# EasyEDA Pro project StageAudioPlayer.eprj

# Schematic Schematic1
Board Name: Board1; Create Date: 2025-11-23; Page Name: P1; Project Name: StageAudioPlayer; Schematic Name: Schematic1; Update Date: 2025-11-23; Company: EasyEDA.com; Page Size: A4; Version: V1.0
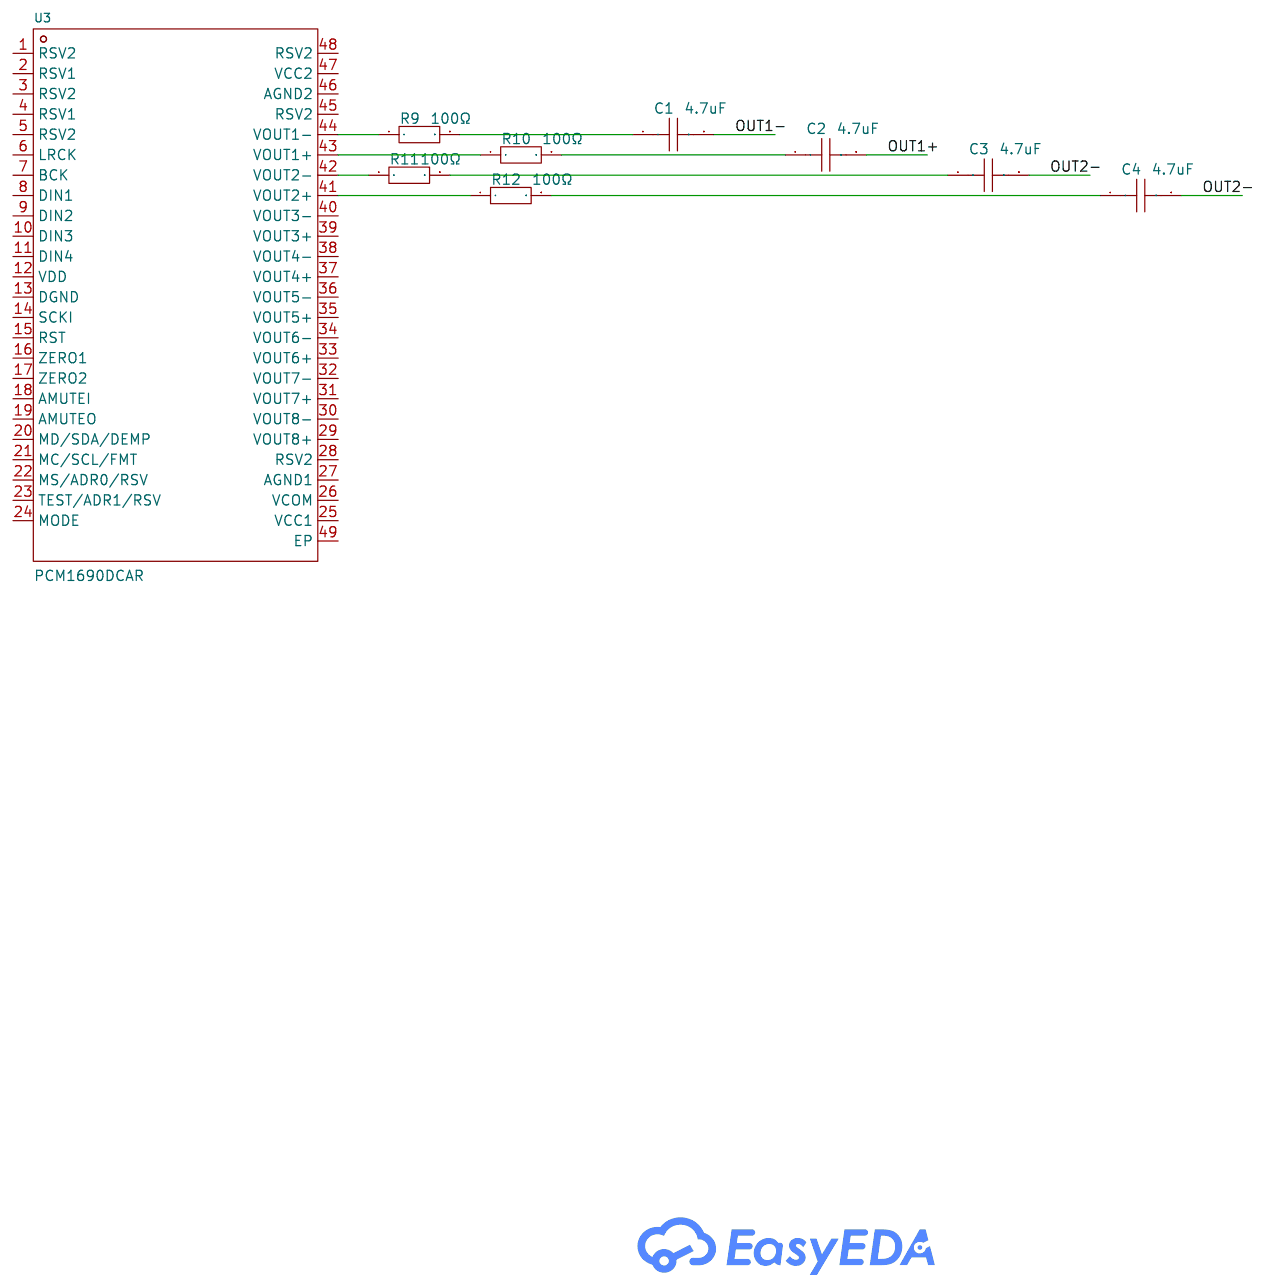
[diagram p0: schematic sheet]

## Parts
C1  4.7uF  [CAP-TH_L28.5-W15.5-P26.0-D0.8]
C2  4.7uF  [CAP-TH_L28.5-W15.5-P26.0-D0.8]
C3  4.7uF  [CAP-TH_L28.5-W15.5-P26.0-D0.8]
C4  4.7uF  [CAP-TH_L28.5-W15.5-P26.0-D0.8]
R9  100Ω  [R0603]
R10  100Ω  [R0603]
R11  100Ω  [R0603]
R12  100Ω  [R0603]
U3  PCM1690DCAR  [HTSSOP-48_L12.5-W6.1-P0.50-LS8.1-BL-EP-1]

## Library data of the parts
C1-C4 = KP475J2J2603: LCSC Part Name: 4.7uF ±5% 630V; Supplier Part: C3019080; Manufacturer: KYET(科雅); Supplier Footprint: 插件,P=26mm; JLCPCB Part Class: Extended Part; Datasheet: https://item.szlcsc.com/datasheet/KP475J2J2603/3534045.html; Supplier: LCSC; Tolerance: ±5%; Voltage Rating: 630V; Operating Temperature: -40℃~+100℃
R9-R12 = 0603WAF1000T5E: LCSC Part Name: 100Ω ±1% 100mW 厚膜电阻; Supplier Part: C22775; Manufacturer: UNI-ROYAL(厚声); Supplier Footprint: 0603; JLCPCB Part Class: Basic Part; Datasheet: https://atta.szlcsc.com/upload/public/pdf/source/20200306/C422600_1E6D84923E4A46A82E41ADD87F860B5C.pdf; Supplier: LCSC; Type: Thick Film Resistors; Tolerance: ±1%; Temperature Coefficient: ±200ppm/℃; Operating Temperature Range: -55℃~+155℃
U3 = PCM1690DCAR: Supplier Part: C181276; Manufacturer: TI(德州仪器); Supplier Footprint: HTSSOP-48-EP-6.1mm; JLCPCB Part Class: Extended Part; Datasheet: https://www.ti.com/cn/lit/gpn/pcm1690; Supplier: LCSC; Resolution(Bits): 24; Number of Channels: 8; Interface: I2C; Voltage - Supply: 4.5V~5.5V; Operating Temperature: -40℃~+85℃; Sampling Rate: 192kHz

## Nets
OUT1+: C2.2
OUT1-: C1.2
OUT2-: C3.2 C4.2
Net-(C1-1): C1.1 R9.2
Net-(C2-1): C2.1 R10.2
Net-(C3-1): C3.1 R11.2
Net-(C4-1): C4.1 R12.2
Net-(R9-1): R9.1 U3.44(VOUT1-)
Net-(R10-1): R10.1 U3.43(VOUT1+)
Net-(R11-1): R11.1 U3.42(VOUT2-)
Net-(R12-1): R12.1 U3.41(VOUT2+)

Not connected (* = marked no-connect by the designer): U3 1(RSV2) 2(RSV1) 3(RSV2) 4(RSV1) 5(RSV2) 6(LRCK) 7(BCK) 8(DIN1) 9(DIN2) 10(DIN3) 11(DIN4) 12(VDD) 13(DGND) 14(SCKI) 15(RST) 16(ZERO1) 17(ZERO2) 18(AMUTEI) 19(AMUTEO) 20(MD/SDA/DEMP) 21(MC/SCL/FMT) 22(MS/ADR0/RSV) 23(TEST/ADR1/RSV) 24(MODE) 25(VCC1) 26(VCOM) 27(AGND1) 28(RSV2) 29(VOUT8+) 30(VOUT8-) 31(VOUT7+) 32(VOUT7-) 33(VOUT6+) 34(VOUT6-) 35(VOUT5+) 36(VOUT5-) 37(VOUT4+) 38(VOUT4-) 39(VOUT3+) 40(VOUT3-) 45(RSV2) 46(AGND2) 47(VCC2) 48(RSV2) 49(EP)
